# Altium schematic sheet CAN.SchDoc
size A4
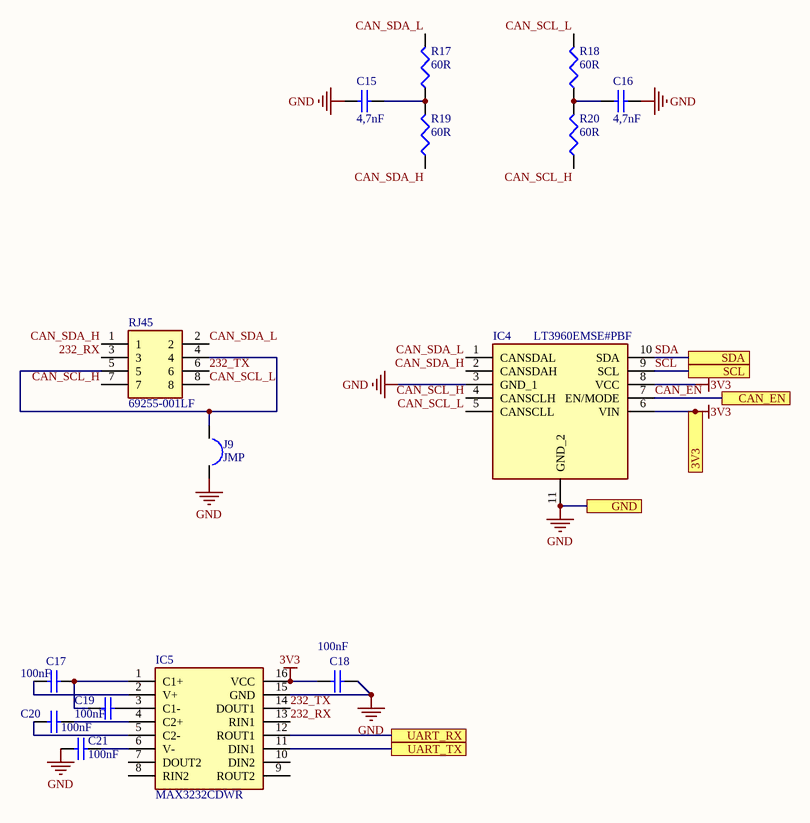
[diagram p0: CAN.SchDoc]

## Parts
C15  4,7nF  [1608[0603]]
C16  4,7nF  [1608[0603]]
C17  100nF  [1608[0603]]
C18  100nF  [1608[0603]]
C19  100nF  [1608[0603]]
C20  100nF  [1608[0603]]
C21  100nF  [1608[0603]]
IC4  LT3960EMSE#PBF  [SOP50P490X110-11N]
IC5  MAX3232CDWR  [SOIC127P1030X265-16N]
J9  JMP  [Jumper]
R17  60R  [J1-0603]
R18  60R  [J1-0603]
R19  60R  [J1-0603]
R20  60R  [J1-0603]
RJ45  69255-001LF  [69255001LF]

## Ports
3V3, CAN_EN, GND, SCL, SDA, UART_RX, UART_TX

## Nets
3V3: C18.2 IC4.6(VIN) IC4.8(VCC) IC5.16(VCC) ; port 3V3
GND: C15.1 C16.2 C18.1 C21.2 IC4.3(GND_1) IC4.11(GND_2) IC5.15(GND) J9.2 ; port GND
232_RX: IC5.13(RIN1) RJ45.3
232_TX: IC5.14(DOUT1) RJ45.6
CAN_EN: IC4.7(EN/MODE) ; port CAN_EN
CAN_SCL_H: IC4.4(CANSCLH) R20.1 RJ45.7
CAN_SCL_L: IC4.5(CANSCLL) R18.2 RJ45.8
CAN_SDA_H: IC4.2(CANSDAH) R19.1 RJ45.1
CAN_SDA_L: IC4.1(CANSDAL) R17.2 RJ45.2
SCL: IC4.9(SCL) ; port SCL
SDA: IC4.10(SDA) ; port SDA
UART_RX: IC5.12(ROUT1) ; port UART_RX
UART_TX: IC5.11(DIN1) ; port UART_TX
NetC15_2: C15.2 R17.1 R19.2
NetC16_1: C16.1 R18.1 R20.2
NetC17_1: C17.1 IC5.2(V+)
NetC17_2: C17.2 C19.2 IC5.1(C1+)
NetC19_1: C19.1 IC5.3(C1-)
NetC20_1: C20.1 IC5.4(C2+)
NetC20_2: C20.2 IC5.5(C2-)
NetC21_1: C21.1 IC5.6(V-)
NetJ9_1: J9.1 RJ45.4 RJ45.5

Not connected (* = marked no-connect by the designer): IC5 7(DOUT2) 8(RIN2) 9(ROUT2) 10(DIN2)

## Library data of the parts
C15-C21 = Cap Semi: Capacitor (Semiconductor SIM Model); Published: 8-Jun-2000; LatestRevisionDate: 29-May-2009; LatestRevisionNote: IPC-7351 Footprint Added.; PackageReference: C1206; Publisher: Altium Limited; PackageDescription: Chip Capacitor
  C15 C16: Value: 4,7nF
  C17-C21: Value: 100nF
IC4 = LT3960EMSE#PBF: Integrated Circuit; Manufacturer_Name: Analog Devices; Datasheet Link: https://www.analog.com/media/en/technical-documentation/data-sheets/lt3960.pdf; Height: 1.1mm; Manufacturer_Part_Number: LT3960EMSE#PBF; Mouser Part Number: 584-LT3960EMSE#PBF; Mouser Price/Stock: https://www.mouser.co.uk/ProductDetail/Analog-Devices/LT3960EMSEPBF?qs=T94vaHKWudT8pvtFFihmNw%3D%3D; Arrow Part Number: LT3960EMSE#PBF; Arrow Price/Stock: https://www.arrow.com/en/products/lt3960emsepbf/analog-devices?region=nac
IC5 = MAX3232CDWR: Integrated Circuit; Manufacturer_Name: Texas Instruments; Datasheet Link: http://www.ti.com/lit/gpn/max3232; Height: 2.65mm; Manufacturer_Part_Number: MAX3232CDWR; Mouser Part Number: 595-MAX3232CDWR; Mouser Price/Stock: https://www.mouser.co.uk/ProductDetail/Texas-Instruments/MAX3232CDWR?qs=0OT4q4QBUTK1ED6%2F6PqD5Q%3D%3D; Arrow Part Number: MAX3232CDWR; Arrow Price/Stock: https://www.arrow.com/en/products/max3232cdwr/texas-instruments?region=nac
R17-R20 = Res3: Resistor; Value: 120R; Published: 8-Jun-2000; LatestRevisionDate: 29-May-2009; LatestRevisionNote: IPC-7351 Footprint Added.; PackageReference: J1-0603; Publisher: Altium Limited; PackageDescription: Chip Resistor
RJ45 = 69255-001LF: Connector; Manufacturer_Name: Amphenol; Datasheet Link: https://www.mouser.de/datasheet/2/18/69255-1363180.pdf; Height: 15.77mm; Manufacturer_Part_Number: 69255-001LF; Mouser Part Number: 649-69255-001LF; Mouser Price/Stock: https://www.mouser.co.uk/ProductDetail/Amphenol-FCI/69255-001LF?qs=NPkb10g2yLBu3oVSGl%2F68w%3D%3D; Arrow Part Number: 69255-001LF; Arrow Price/Stock: https://www.arrow.com/en/products/69255-001lf/amphenol-fci